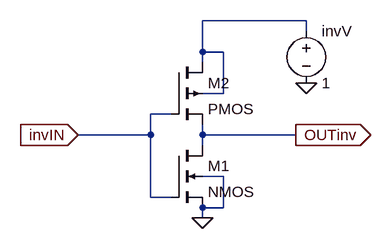
[diagram p0: schematic Draft6.asc]
Draft6.asc, the LTspice schematic file:
Version 4
SHEET 1 880 680
WIRE 384 0 224 0
WIRE 384 16 384 0
WIRE 224 48 224 0
WIRE 256 48 224 48
WIRE 224 64 224 48
WIRE 256 112 256 48
WIRE 256 112 224 112
WIRE 176 144 144 144
WIRE 144 176 144 144
WIRE 144 176 32 176
WIRE 224 176 224 160
WIRE 368 176 224 176
WIRE 224 192 224 176
WIRE 256 240 224 240
WIRE 144 272 144 176
WIRE 176 272 144 272
WIRE 256 288 256 240
WIRE 256 288 224 288
WIRE 224 304 224 288
FLAG 224 304 0
FLAG 368 176 OUTinv
IOPIN 368 176 Out
FLAG 32 176 invIN
IOPIN 32 176 In
FLAG 384 96 0
SYMBOL nmos4 176 192 R0
SYMATTR InstName M1
SYMBOL pmos4 176 64 R0
SYMATTR InstName M2
SYMBOL voltage 384 0 R0
SYMATTR InstName invV
SYMATTR Value 1

The netlist it stands for:
* Draft6.asc
M1 OUTinv invIN 0 0 NMOS
M2 N001 invIN OUTinv N001 PMOS
V§invV N001 0 1
.model NMOS NMOS
.model PMOS PMOS
.lib standard.mos
.backanno
.end